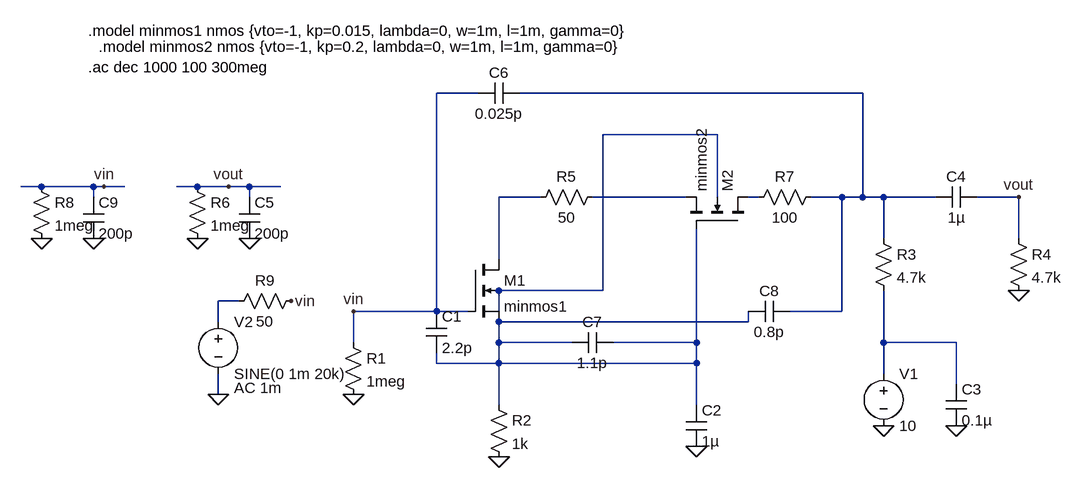
[diagram p0: schematic simulacion.asc]
simulacion.asc, the LTspice schematic file:
Version 4
SHEET 1 1160 680
WIRE 256 32 192 32
WIRE 848 32 320 32
WIRE 624 96 448 96
WIRE -416 176 -448 176
WIRE -336 176 -416 176
WIRE -320 176 -336 176
WIRE -288 176 -320 176
WIRE -176 176 -208 176
WIRE -128 176 -176 176
WIRE -96 176 -128 176
WIRE -48 176 -96 176
WIRE -336 192 -336 176
WIRE -96 192 -96 176
WIRE 352 192 288 192
WIRE 576 192 432 192
WIRE 624 192 624 96
WIRE 688 192 672 192
WIRE 816 192 768 192
WIRE 848 192 848 32
WIRE 848 192 816 192
WIRE 880 192 848 192
WIRE 960 192 880 192
WIRE 1088 192 1024 192
WIRE 880 256 880 192
WIRE 1088 256 1088 192
WIRE 288 288 288 192
WIRE 448 336 448 96
WIRE 448 336 288 336
WIRE -112 352 -144 352
WIRE 192 368 192 32
WIRE 192 368 64 368
WIRE 240 368 192 368
WIRE 288 368 288 336
WIRE 816 368 816 192
WIRE 816 368 736 368
WIRE -144 384 -144 352
WIRE 672 384 672 368
WIRE 672 384 288 384
WIRE 64 416 64 368
WIRE 288 416 288 384
WIRE 400 416 288 416
WIRE 592 416 592 240
WIRE 592 416 464 416
WIRE 880 416 880 336
WIRE 992 416 880 416
WIRE 192 448 192 432
WIRE 288 448 288 416
WIRE 288 448 192 448
WIRE 592 448 592 416
WIRE 592 448 288 448
WIRE 880 464 880 416
WIRE 992 480 992 416
WIRE -144 496 -144 464
WIRE 288 512 288 448
WIRE 592 512 592 448
FLAG 64 496 0
FLAG 288 592 0
FLAG 592 576 0
FLAG 880 544 0
FLAG 992 544 0
FLAG 1088 336 0
FLAG -144 496 0
FLAG 64 368 vin
FLAG 1088 192 vout
FLAG -96 256 0
FLAG -176 256 0
FLAG -336 256 0
FLAG -416 256 0
FLAG -32 352 vin
FLAG -320 176 vin
FLAG -128 176 vout
SYMBOL nmos4 240 288 R0
SYMATTR InstName M1
SYMATTR Value minmos1
SYMBOL nmos4 672 240 M270
SYMATTR InstName M2
SYMATTR Value minmos2
SYMBOL res 48 400 R0
SYMATTR InstName R1
SYMATTR Value 1meg
SYMBOL res 272 496 R0
SYMATTR InstName R2
SYMATTR Value 1k
SYMBOL res 864 240 R0
SYMATTR InstName R3
SYMATTR Value 4.7k
SYMBOL res 1072 240 R0
SYMATTR InstName R4
SYMATTR Value 4.7k
SYMBOL cap 576 512 R0
SYMATTR InstName C2
SYMATTR Value 1µ
SYMBOL cap 976 480 R0
SYMATTR InstName C3
SYMATTR Value 0.1µ
SYMBOL cap 1024 176 R90
WINDOW 0 0 32 VBottom 2
WINDOW 3 32 32 VTop 2
SYMATTR InstName C4
SYMATTR Value 1µ
SYMBOL voltage 880 448 R0
SYMATTR InstName V1
SYMATTR Value 10
SYMBOL voltage -144 368 R0
WINDOW 123 24 118 Left 2
SYMATTR Value2 AC 1m
SYMATTR InstName V2
SYMATTR Value SINE(0 1m 20k)
SYMBOL res -192 160 R0
SYMATTR InstName R6
SYMATTR Value 1meg
SYMBOL cap -112 192 R0
SYMATTR InstName C5
SYMATTR Value 200p
SYMBOL cap 176 368 R0
SYMATTR InstName C1
SYMATTR Value 2.2p
SYMBOL cap 320 16 R90
WINDOW 0 0 32 VBottom 2
WINDOW 3 32 32 VTop 2
SYMATTR InstName C6
SYMATTR Value 0.025p
SYMBOL cap 464 400 R90
WINDOW 0 0 32 VBottom 2
WINDOW 3 32 32 VTop 2
SYMATTR InstName C7
SYMATTR Value 1.1p
SYMBOL cap 736 352 R90
WINDOW 0 0 32 VBottom 2
WINDOW 3 32 32 VTop 2
SYMATTR InstName C8
SYMATTR Value 0.8p
SYMBOL res 448 176 R90
WINDOW 0 0 56 VBottom 2
WINDOW 3 32 56 VTop 2
SYMATTR InstName R5
SYMATTR Value 50
SYMBOL res 784 176 R90
WINDOW 0 0 56 VBottom 2
WINDOW 3 32 56 VTop 2
SYMATTR InstName R7
SYMATTR Value 100
SYMBOL res -432 160 R0
SYMATTR InstName R8
SYMATTR Value 1meg
SYMBOL cap -352 192 R0
SYMATTR InstName C9
SYMATTR Value 200p
SYMBOL res -16 336 R90
WINDOW 0 0 56 VBottom 2
WINDOW 3 32 56 VTop 2
SYMATTR InstName R9
SYMATTR Value 50
TEXT -344 -64 Left 2 !.model minmos1 nmos {vto=-1, kp=0.015, lambda=0, w=1m, l=1m, gamma=0}
TEXT -328 -40 Left 2 !.model minmos2 nmos {vto=-1, kp=0.2, lambda=0, w=1m, l=1m, gamma=0}
TEXT -344 -8 Left 2 !.ac dec 1000 100 300meg

The netlist it stands for:
* simulacion.asc
M1 N003 vin N007 N002 minmos1
M2 N005 N007 N004 N002 minmos2
R1 vin 0 1meg
R2 N007 0 1k
R3 N001 N008 4.7k
R4 vout 0 4.7k
C2 N007 0 1µ
C3 N008 0 0.1µ
C4 vout N001 1µ
V1 N008 0 10
V2 N006 0 SINE(0 1m 20k) AC 1m
R6 vout 0 1meg
C5 vout 0 200p
C1 vin N007 2.2p
C6 N001 vin 0.025p
C7 N007 N007 1.1p
C8 N001 N007 0.8p
R5 N004 N003 50
R7 N001 N005 100
R8 vin 0 1meg
C9 vin 0 200p
R9 vin N006 50
.model NMOS NMOS
.model PMOS PMOS
.lib standard.mos
.model minmos1 nmos {vto=-1, kp=0.015, lambda=0, w=1m, l=1m, gamma=0}
.model minmos2 nmos {vto=-1, kp=0.2, lambda=0, w=1m, l=1m, gamma=0}
.ac dec 1000 100 300meg
.backanno
.end